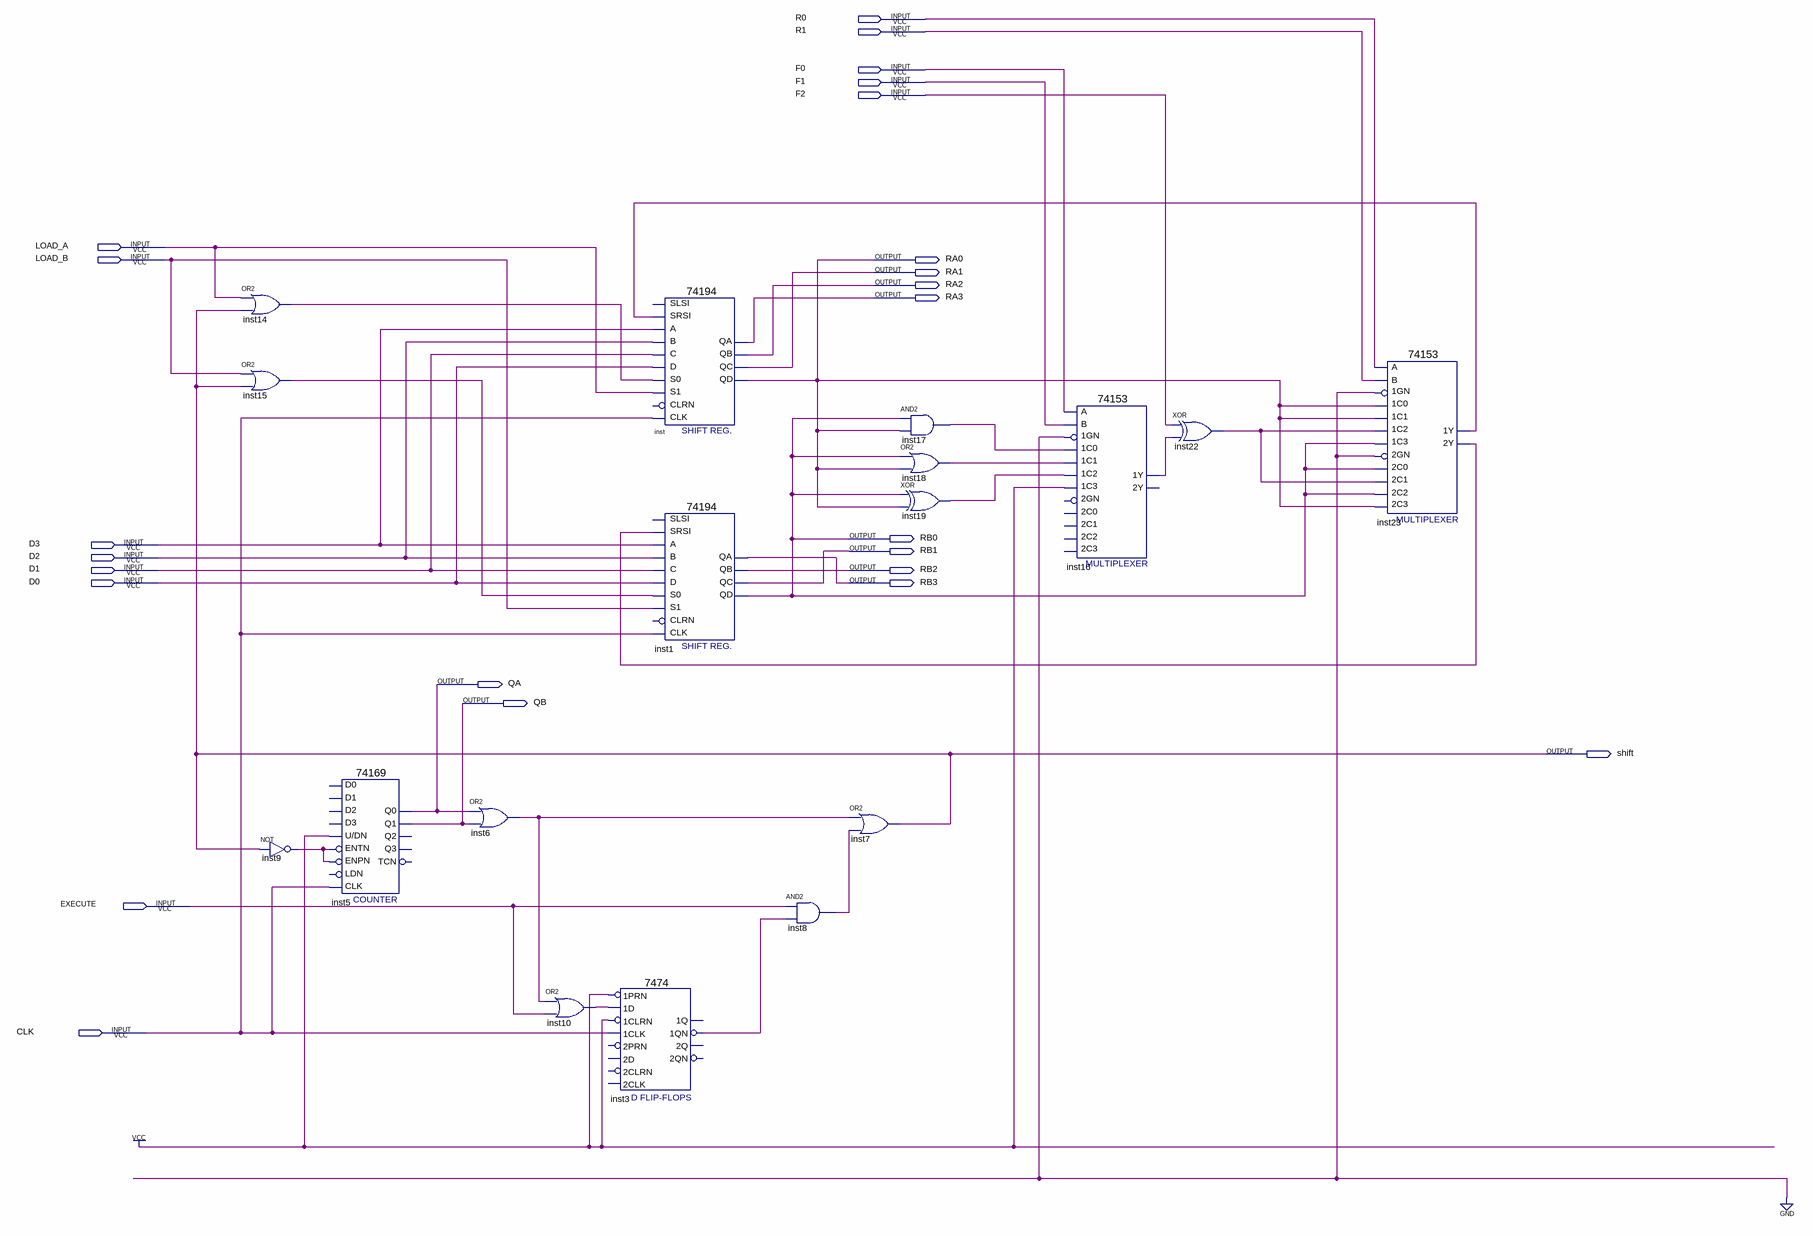
[diagram p0: schematic sheet]
// Quartus schematic lab3.bdf as structural Verilog: 17 symbols, 24 pins
module lab3 (
  input  R0,
  input  R1,
  input  F0,
  input  F1,
  input  F2,
  input  LOAD_A,
  input  LOAD_B,
  input  D3,
  input  D2,
  input  D1,
  input  D0,
  input  EXECUTE,
  input  CLK,
  output RA0,
  output RA1,
  output RA2,
  output RA3,
  output RB0,
  output RB1,
  output RB2,
  output RB3,
  output QA,
  output QB,
  output shift
);

  wire inst3_1qn, inst6_out, inst8_out, inst9_out, inst10_out, inst14_out, inst15_out, inst16_1y, inst17_out,
       inst18_out, inst19_out, inst22_out, inst23_1y, inst23_2y;

  or inst14 (inst14_out, LOAD_A, shift);
  or inst15 (inst15_out, LOAD_B, shift);
  not inst9 (inst9_out, shift);
  \74169  inst5 (
    .ENTN(inst9_out), .\U/DN (1'b1), .CLK(CLK), .ENPN(inst9_out), .Q1(QB), .Q0(QA));  // open: D1, D2, D0, D3, LDN, Q2, TCN, Q3
  or inst6 (inst6_out, QA, QB);
  or inst10 (inst10_out, inst6_out, EXECUTE);
  \7474  inst3 (
    .\1CLK (CLK), .\1D (inst10_out), .\1PRN (1'b1), .\1CLRN (1'b1), .\1QN (inst3_1qn));  // open: 2D, 2PRN, 2CLK, 2CLRN, 2Q, 2QN, 1Q
  \74194  inst (
    .SRSI(inst23_1y), .B(D2), .C(D1), .CLK(CLK), .D(D0), .S1(LOAD_A), .S0(inst14_out), .A(D3), .QA(RA3),
    .QB(RA2), .QC(RA1), .QD(RA0));  // open: SLSI, CLRN
  \74194  inst1 (
    .SRSI(inst23_2y), .B(D2), .C(D1), .CLK(CLK), .D(D0), .S1(LOAD_B), .S0(inst15_out), .A(D3), .QA(RB3),
    .QB(RB2), .QC(RB1), .QD(RB0));  // open: SLSI, CLRN
  and inst8 (inst8_out, EXECUTE, inst3_1qn);
  or inst7 (shift, inst6_out, inst8_out);
  and inst17 (inst17_out, RB0, RA0);
  or inst18 (inst18_out, RB0, RA0);
  xor inst19 (inst19_out, RB0, RA0);
  \74153  inst16 (
    .\1C1 (inst18_out), .\1GN (1'b0), .\1C0 (inst17_out), .\1C2 (inst19_out), .\1C3 (1'b1), .B(F1), .A(F0),
    .\1Y (inst16_1y));  // open: 2C0, 2GN, 2C2, 2C1, 2C3, 2Y
  xor inst22 (inst22_out, F2, inst16_1y);
  \74153  inst23 (
    .\1C1 (RA0), .\1GN (1'b0), .\1C0 (RA0), .\2C0 (RB0), .\2GN (1'b0), .\2C2 (RB0), .\1C2 (inst22_out),
    .\1C3 (RB0), .B(R1), .A(R0), .\2C1 (inst22_out), .\2C3 (RA0), .\1Y (inst23_1y), .\2Y (inst23_2y));
endmodule
